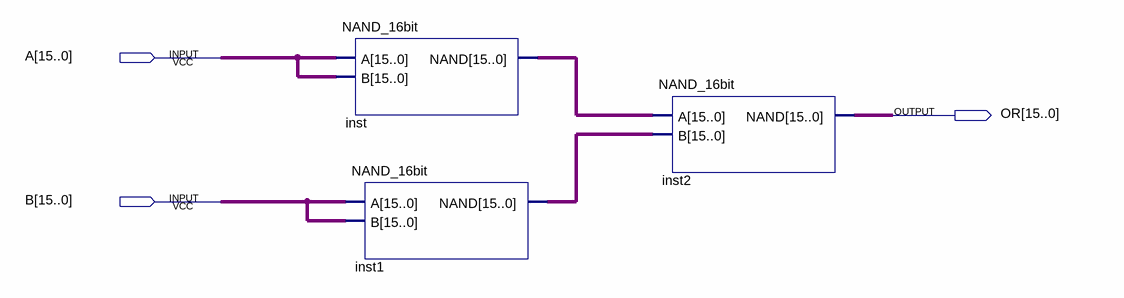
[diagram p0: schematic sheet]
// Quartus schematic OR16bit.bdf as structural Verilog: 3 symbols, 3 pins
module OR16bit (
  input  [15:0] A,
  input  [15:0] B,
  output [15:0] OR
);

  wire [15:0] inst1_nand, inst_nand;

  NAND_16bit inst (.A(A), .B(A), .NAND(inst_nand));
  NAND_16bit inst1 (.A(B), .B(B), .NAND(inst1_nand));
  NAND_16bit inst2 (.A(inst_nand), .B(inst1_nand), .NAND(OR));
endmodule
